# Altium schematic sheet MPU&DDR.SchDoc
size A2
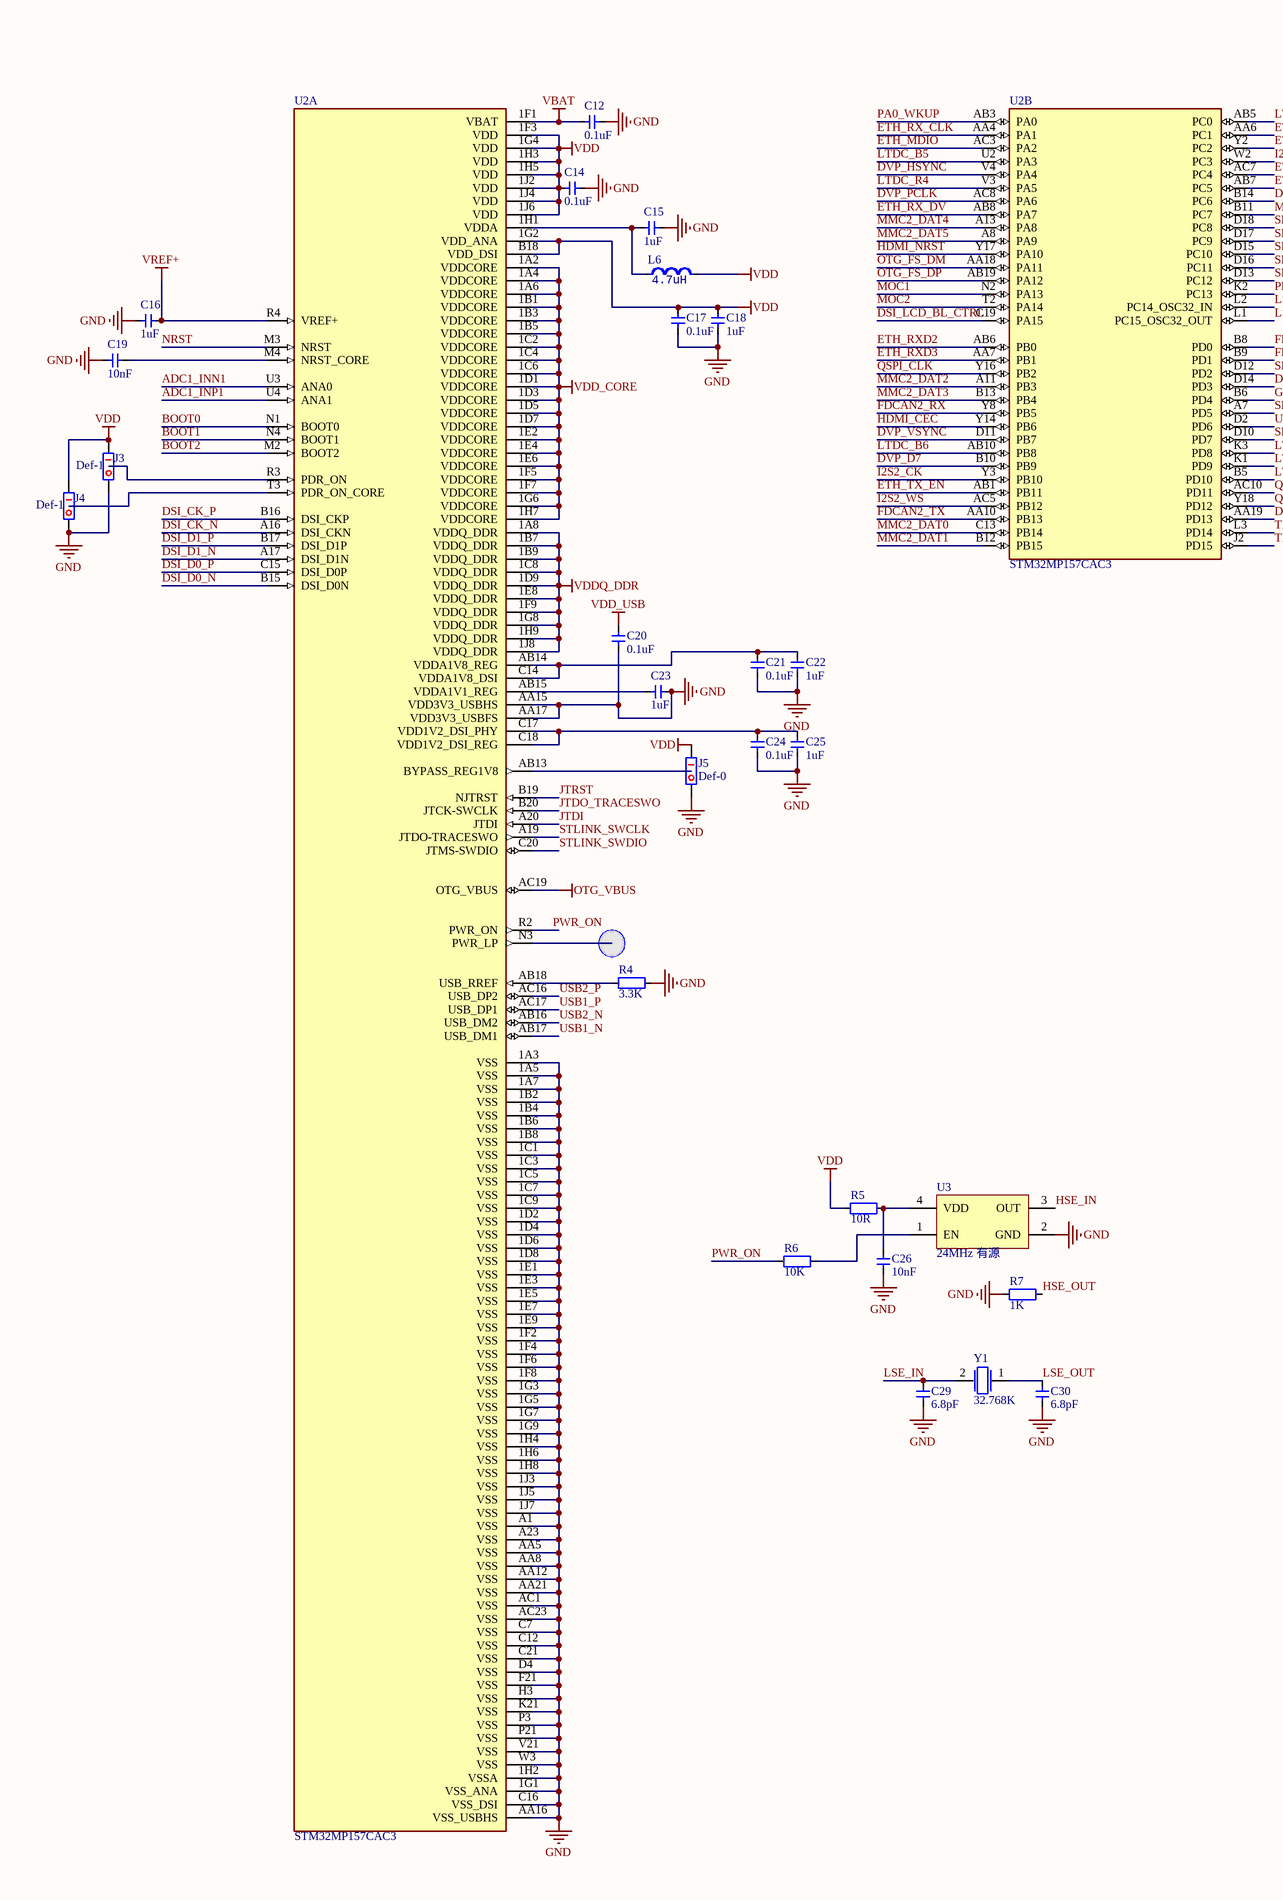
[diagram p0: MPU&DDR.SchDoc, left]
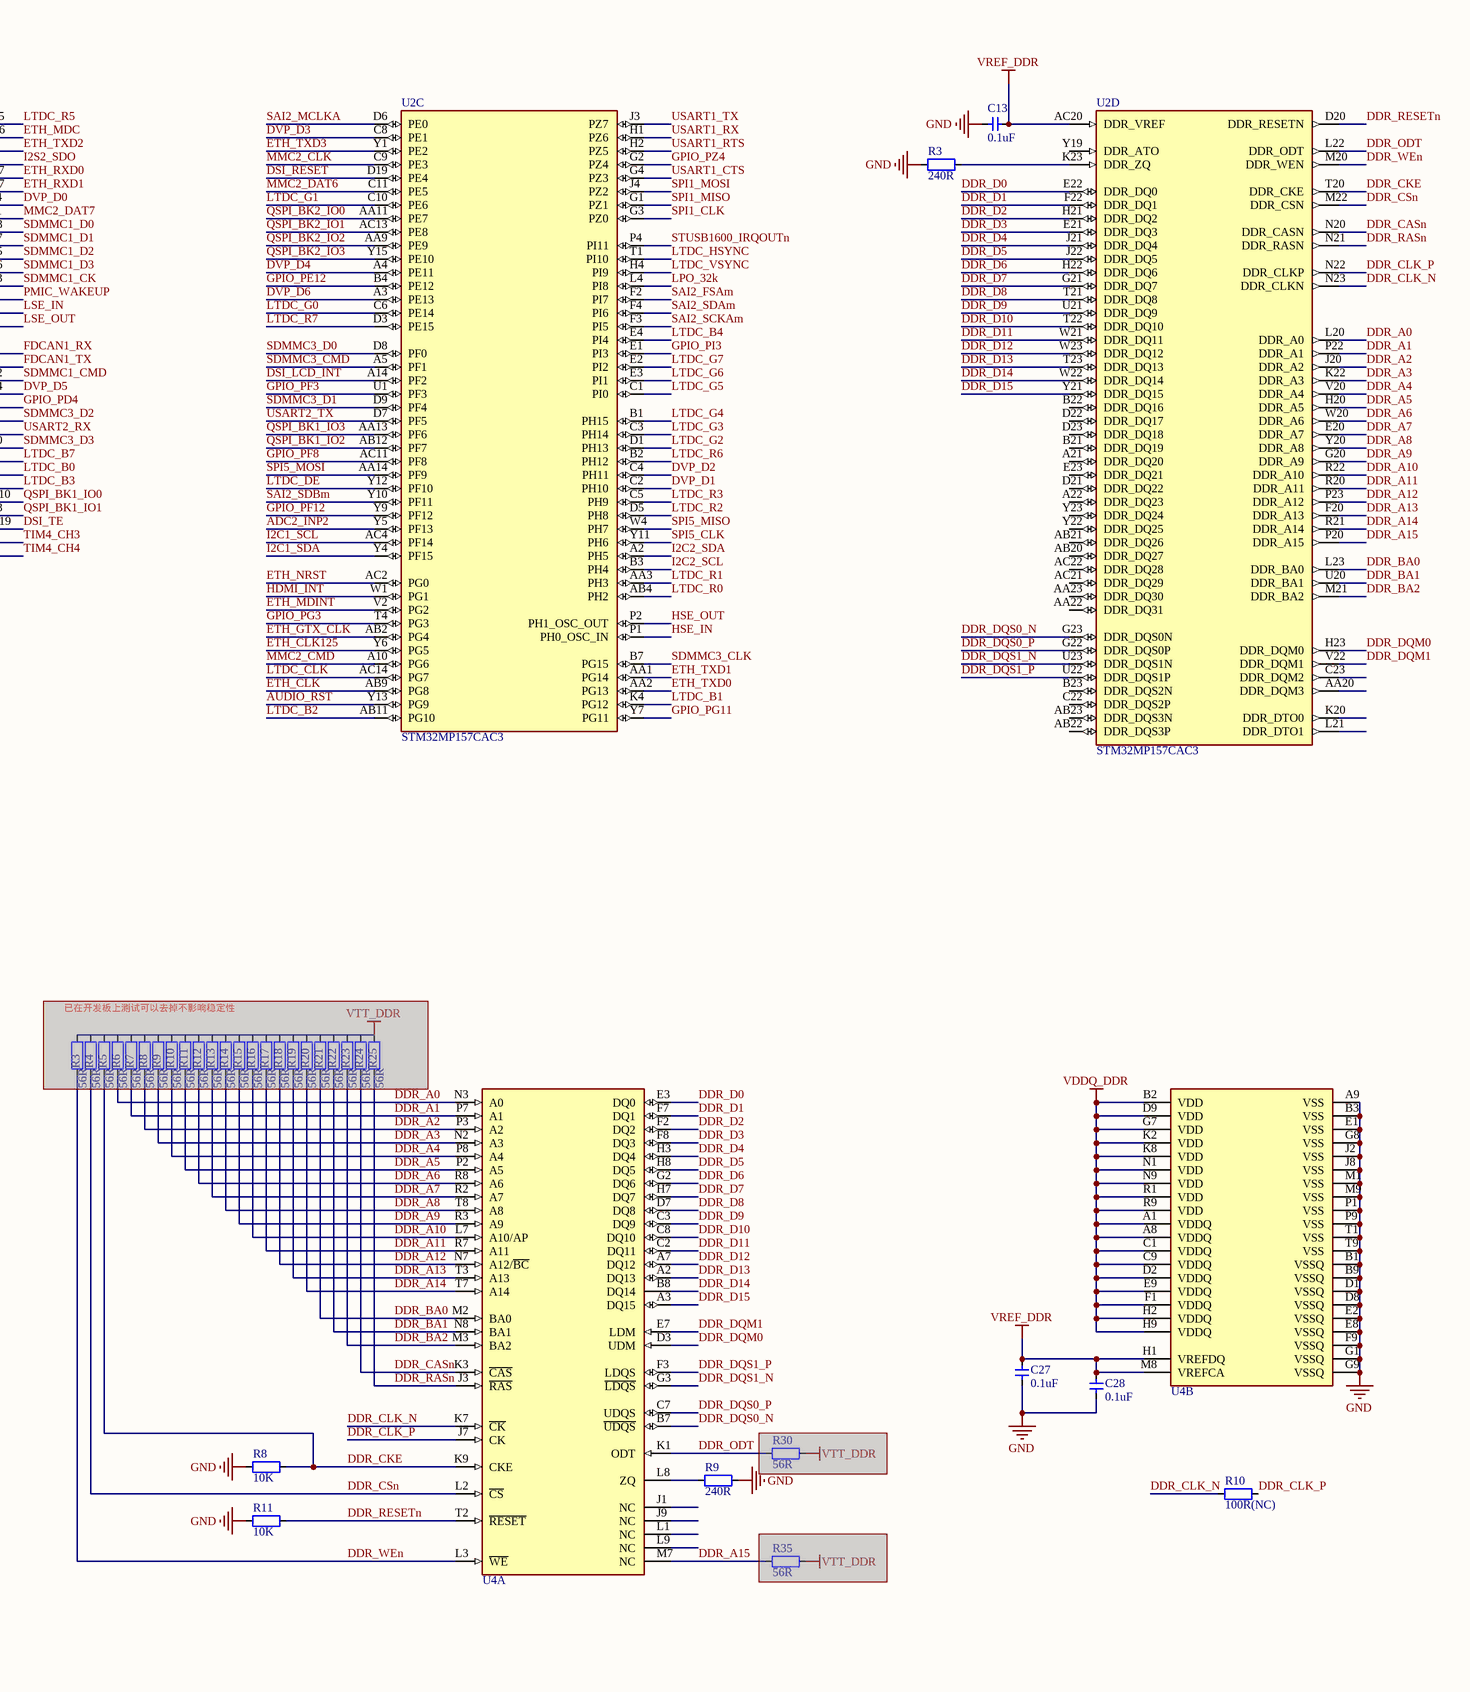
[diagram p1: MPU&DDR.SchDoc, right]

## Parts
(Parts that share a designator on the sheet are numbered #1, #2 ... from top to bottom, then left to right.)
C12  0.1uF  [CAP_0402]
C13  0.1uF  [CAP_0402]
C14  0.1uF  [CAP_0402]
C15  1uF  [CAP_0402]
C16  1uF  [CAP_0402]
C17  0.1uF  [CAP_0402]
C18  1uF  [CAP_0402]
C19  10nF  [CAP_0402]
C20  0.1uF  [CAP_0402]
C21  0.1uF  [CAP_0402]
C22  1uF  [CAP_0402]
C23  1uF  [CAP_0402]
C24  0.1uF  [CAP_0402]
C25  1uF  [CAP_0402]
C26  10nF  [CAP_0402]
C27  0.1uF  [CAP_0402]
C28  0.1uF  [CAP_0402]
C29  6.8pF  [CAP_0402]
C30  6.8pF  [CAP_0402]
J3  Def-1  [jumper-3]
J4  Def-1  [jumper-3]
J5  Def-0  [jumper-3]
L6  4.7uH  [IND_0603]
R3#1  240R  [RES_0402]
R3#2  56R  [RES_0402]  (masked out: inside a compile mask, not in the netlist)
R4#1  3.3K  [RES_0402]
R4#2  56R  [RES_0402]  (masked out: inside a compile mask, not in the netlist)
R5#1  56R  [RES_0402]  (masked out: inside a compile mask, not in the netlist)
R5#2  10R  [RES_0402]
R6#1  56R  [RES_0402]  (masked out: inside a compile mask, not in the netlist)
R6#2  10K  [RES_0402]
R7#1  56R  [RES_0402]  (masked out: inside a compile mask, not in the netlist)
R7#2  1K  [RES_0402]
R8#1  56R  [RES_0402]  (masked out: inside a compile mask, not in the netlist)
R8#2  10K  [RES_0402]
R9#1  56R  [RES_0402]  (masked out: inside a compile mask, not in the netlist)
R9#2  240R  [RES_0402]
R10#1  56R  [RES_0402]  (masked out: inside a compile mask, not in the netlist)
R10#2  100R(NC)  [RES_0402]
R11#1  56R  [RES_0402]  (masked out: inside a compile mask, not in the netlist)
R11#2  10K  [RES_0402]
R12  56R  [RES_0402]  (masked out: inside a compile mask, not in the netlist)
R13  56R  [RES_0402]  (masked out: inside a compile mask, not in the netlist)
R14  56R  [RES_0402]  (masked out: inside a compile mask, not in the netlist)
R15  56R  [RES_0402]  (masked out: inside a compile mask, not in the netlist)
R16  56R  [RES_0402]  (masked out: inside a compile mask, not in the netlist)
R17  56R  [RES_0402]  (masked out: inside a compile mask, not in the netlist)
R18  56R  [RES_0402]  (masked out: inside a compile mask, not in the netlist)
R19  56R  [RES_0402]  (masked out: inside a compile mask, not in the netlist)
R20  56R  [RES_0402]  (masked out: inside a compile mask, not in the netlist)
R21  56R  [RES_0402]  (masked out: inside a compile mask, not in the netlist)
R22  56R  [RES_0402]  (masked out: inside a compile mask, not in the netlist)
R23  56R  [RES_0402]  (masked out: inside a compile mask, not in the netlist)
R24  56R  [RES_0402]  (masked out: inside a compile mask, not in the netlist)
R25  56R  [RES_0402]  (masked out: inside a compile mask, not in the netlist)
R30  56R  [RES_0402]  (masked out: inside a compile mask, not in the netlist)
R35  56R  [RES_0402]  (masked out: inside a compile mask, not in the netlist)
T1  测试点  [TEST_PT]  (value not drawn)
U2  STM32MP157CAC3  [STM32MP157CAC3]  (parts A,B,C,D of 4)
U3  24MHz 有源  [晶振2520]
U4  MT41K256M16TW-107-P  [Micron_DDR]  (value not drawn)  (parts A,B of 2)
Y1  32.768K  [晶振-2P-2012]

## Nets
GND: C12.1 C13.2 C14.1 C15.1 C16.2 C17.2 C18.2 C19.1 C20.2 C21.2 C22.2 C23.1 C24.2 C25.2 C26.1 C27.1 C28.1 C29.1 C30.1 J3.1 J4.1 J5.1 R3#1.1 R4#1.2 R7#2.1 R8#2.2 R9#2.2 R11#2.2 U2.1A3(VSS) U2.1A5(VSS) U2.1A7(VSS) U2.1B2(VSS) U2.1B4(VSS) U2.1B6(VSS) U2.1B8(VSS) U2.1C1(VSS) U2.1C3(VSS) U2.1C5(VSS) U2.1C7(VSS) U2.1C9(VSS) U2.1D2(VSS) U2.1D4(VSS) U2.1D6(VSS) U2.1D8(VSS) U2.1E1(VSS) U2.1E3(VSS) U2.1E5(VSS) U2.1E7(VSS) U2.1E9(VSS) U2.1F2(VSS) U2.1F4(VSS) U2.1F6(VSS) U2.1F8(VSS) U2.1G1(VSS_ANA) U2.1G3(VSS) U2.1G5(VSS) U2.1G7(VSS) U2.1G9(VSS) U2.1H2(VSSA) U2.1H4(VSS) U2.1H6(VSS) U2.1H8(VSS) U2.1J3(VSS) U2.1J5(VSS) U2.1J7(VSS) U2.A1(VSS) U2.A23(VSS) U2.AA5(VSS) U2.AA8(VSS) U2.AA12(VSS) U2.AA15(VDD3V3_USBHS) U2.AA16(VSS_USBHS) U2.AA17(VDD3V3_USBFS) U2.AA21(VSS) U2.AC1(VSS) U2.AC23(VSS) U2.C7(VSS) U2.C12(VSS) U2.C16(VSS_DSI) U2.C21(VSS) U2.D4(VSS) U2.F21(VSS) U2.H3(VSS) U2.K21(VSS) U2.P3(VSS) U2.P21(VSS) U2.V21(VSS) U2.W3(VSS) U3.2(GND) U4.A9(VSS) U4.B1(VSSQ) U4.B3(VSS) U4.B9(VSSQ) U4.D1(VSSQ) U4.D8(VSSQ) U4.E1(VSS) U4.E2(VSSQ) U4.E8(VSSQ) U4.F9(VSSQ) U4.G1(VSSQ) U4.G8(VSS) U4.G9(VSSQ) U4.J2(VSS) U4.J8(VSS) U4.M1(VSS) U4.M9(VSS) U4.P1(VSS) U4.P9(VSS) U4.T1(VSS) U4.T9(VSS)
OTG_VBUS: U2.AC19(OTG_VBUS)
VBAT: C12.2 U2.1F1(VBAT)
VDD: C14.2 C17.1 C18.1 J3.3 J4.3 J5.3 L6.2 R5#2.1 U2.1F3(VDD) U2.1G2(VDD_ANA) U2.1G4(VDD) U2.1H3(VDD) U2.1H5(VDD) U2.1J2(VDD) U2.1J4(VDD) U2.1J6(VDD) U2.B18(VDD_DSI)
VDD_CORE: U2.1A2(VDDCORE) U2.1A4(VDDCORE) U2.1A6(VDDCORE) U2.1B1(VDDCORE) U2.1B3(VDDCORE) U2.1B5(VDDCORE) U2.1C2(VDDCORE) U2.1C4(VDDCORE) U2.1C6(VDDCORE) U2.1D1(VDDCORE) U2.1D3(VDDCORE) U2.1D5(VDDCORE) U2.1D7(VDDCORE) U2.1E2(VDDCORE) U2.1E4(VDDCORE) U2.1E6(VDDCORE) U2.1F5(VDDCORE) U2.1F7(VDDCORE) U2.1G6(VDDCORE) U2.1H7(VDDCORE)
VDD_USB: C20.1
VDDQ_DDR: U2.1A8(VDDQ_DDR) U2.1B7(VDDQ_DDR) U2.1B9(VDDQ_DDR) U2.1C8(VDDQ_DDR) U2.1D9(VDDQ_DDR) U2.1E8(VDDQ_DDR) U2.1F9(VDDQ_DDR) U2.1G8(VDDQ_DDR) U2.1H9(VDDQ_DDR) U2.1J8(VDDQ_DDR) U4.A1(VDDQ) U4.A8(VDDQ) U4.B2(VDD) U4.C1(VDDQ) U4.C9(VDDQ) U4.D2(VDDQ) U4.D9(VDD) U4.E9(VDDQ) U4.F1(VDDQ) U4.G7(VDD) U4.H2(VDDQ) U4.H9(VDDQ) U4.K2(VDD) U4.K8(VDD) U4.N1(VDD) U4.N9(VDD) U4.R1(VDD) U4.R9(VDD)
VREF+: C16.1 U2.R4(VREF+)
VREF_DDR: C13.1 C27.2 C28.2 U2.AC20(DDR_VREF) U4.H1(VREFDQ) U4.M8(VREFCA)
ADC1_INN1: U2.U3(ANA0)
ADC1_INP1: U2.U4(ANA1)
ADC2_INP2: U2.Y5(PF13)
AUDIO_RST: U2.Y13(PG9)
BOOT0: U2.N1(BOOT0)
BOOT1: U2.N4(BOOT1)
BOOT2: U2.M2(BOOT2)
DDR_A0: U2.L20(DDR_A0) U4.N3(A0)
DDR_A1: U2.P22(DDR_A1) U4.P7(A1)
DDR_A2: U2.J20(DDR_A2) U4.P3(A2)
DDR_A3: U2.K22(DDR_A3) U4.N2(A3)
DDR_A4: U2.V20(DDR_A4) U4.P8(A4)
DDR_A5: U2.H20(DDR_A5) U4.P2(A5)
DDR_A6: U2.W20(DDR_A6) U4.R8(A6)
DDR_A7: U2.E20(DDR_A7) U4.R2(A7)
DDR_A8: U2.Y20(DDR_A8) U4.T8(A8)
DDR_A9: U2.G20(DDR_A9) U4.R3(A9)
DDR_A10: U2.R22(DDR_A10) U4.L7(A10/AP)
DDR_A11: U2.R20(DDR_A11) U4.R7(A11)
DDR_A12: U2.P23(DDR_A12) U4.N7(A12/~{BC})
DDR_A13: U2.F20(DDR_A13) U4.T3(A13)
DDR_A14: U2.R21(DDR_A14) U4.T7(A14)
DDR_A15: U2.P20(DDR_A15) U4.M7(NC)
DDR_BA0: U2.L23(DDR_BA0) U4.M2(BA0)
DDR_BA1: U2.U20(DDR_BA1) U4.N8(BA1)
DDR_BA2: U2.M21(DDR_BA2) U4.M3(BA2)
DDR_CASn: U2.N20(DDR_CASN) U4.K3(~{CAS})
DDR_CKE: R8#2.1 U2.T20(DDR_CKE) U4.K9(CKE)
DDR_CLK_N: R10#2.1 U2.N23(DDR_CLKN) U4.K7(~{CK})
DDR_CLK_P: R10#2.2 U2.N22(DDR_CLKP) U4.J7(CK)
DDR_CSn: U2.M22(DDR_CSN) U4.L2(~{CS})
DDR_D0: U2.E22(DDR_DQ0) U4.E3(DQ0)
DDR_D1: U2.F22(DDR_DQ1) U4.F7(DQ1)
DDR_D2: U2.H21(DDR_DQ2) U4.F2(DQ2)
DDR_D3: U2.E21(DDR_DQ3) U4.F8(DQ3)
DDR_D4: U2.J21(DDR_DQ4) U4.H3(DQ4)
DDR_D5: U2.J22(DDR_DQ5) U4.H8(DQ5)
DDR_D6: U2.H22(DDR_DQ6) U4.G2(DQ6)
DDR_D7: U2.G21(DDR_DQ7) U4.H7(DQ7)
DDR_D8: U2.T21(DDR_DQ8) U4.D7(DQ8)
DDR_D9: U2.U21(DDR_DQ9) U4.C3(DQ9)
DDR_D10: U2.T22(DDR_DQ10) U4.C8(DQ10)
DDR_D11: U2.W21(DDR_DQ11) U4.C2(DQ11)
DDR_D12: U2.W23(DDR_DQ12) U4.A7(DQ12)
DDR_D13: U2.T23(DDR_DQ13) U4.A2(DQ13)
DDR_D14: U2.W22(DDR_DQ14) U4.B8(DQ14)
DDR_D15: U2.Y21(DDR_DQ15) U4.A3(DQ15)
DDR_DQM0: U2.H23(DDR_DQM0) U4.D3(UDM)
DDR_DQM1: U2.V22(DDR_DQM1) U4.E7(LDM)
DDR_DQS0_N: U2.G23(DDR_DQS0N) U4.B7(~{UDQS})
DDR_DQS0_P: U2.G22(DDR_DQS0P) U4.C7(UDQS)
DDR_DQS1_N: U2.U23(DDR_DQS1N) U4.G3(~{LDQS})
DDR_DQS1_P: U2.U22(DDR_DQS1P) U4.F3(LDQS)
DDR_ODT: U2.L22(DDR_ODT) U4.K1(ODT)
DDR_RASn: U2.N21(DDR_RASN) U4.J3(~{RAS})
DDR_RESETn: R11#2.1 U2.D20(DDR_RESETN) U4.T2(~{RESET})
DDR_WEn: U2.M20(DDR_WEN) U4.L3(~{WE})
DSI_CK_N: U2.A16(DSI_CKN)
DSI_CK_P: U2.B16(DSI_CKP)
DSI_D0_N: U2.B15(DSI_D0N)
DSI_D0_P: U2.C15(DSI_D0P)
DSI_D1_N: U2.A17(DSI_D1N)
DSI_D1_P: U2.B17(DSI_D1P)
DSI_LCD_BL_CTRL: U2.C19(PA15)
DSI_LCD_INT: U2.A14(PF2)
DSI_RESET: U2.D19(PE4)
DSI_TE: U2.AA19(PD13)
DVP_D0: U2.B14(PC6)
DVP_D1: U2.C2(PH10)
DVP_D2: U2.C4(PH11)
DVP_D3: U2.C8(PE1)
DVP_D4: U2.A4(PE11)
DVP_D5: U2.D14(PD3)
DVP_D6: U2.A3(PE13)
DVP_D7: U2.B10(PB9)
DVP_HSYNC: U2.V4(PA4)
DVP_PCLK: U2.AC8(PA6)
DVP_VSYNC: U2.D11(PB7)
ETH_CLK: U2.AB9(PG8)
ETH_CLK125: U2.Y6(PG5)
ETH_GTX_CLK: U2.AB2(PG4)
ETH_MDC: U2.AA6(PC1)
ETH_MDINT: U2.V2(PG2)
ETH_MDIO: U2.AC3(PA2)
ETH_NRST: U2.AC2(PG0)
ETH_RX_CLK: U2.AA4(PA1)
ETH_RX_DV: U2.AB8(PA7)
ETH_RXD0: U2.AC7(PC4)
ETH_RXD1: U2.AB7(PC5)
ETH_RXD2: U2.AB6(PB0)
ETH_RXD3: U2.AA7(PB1)
ETH_TX_EN: U2.AB1(PB11)
ETH_TXD0: U2.AA2(PG13)
ETH_TXD1: U2.AA1(PG14)
ETH_TXD2: U2.Y2(PC2)
ETH_TXD3: U2.Y1(PE2)
FDCAN1_RX: U2.B8(PD0)
FDCAN1_TX: U2.B9(PD1)
FDCAN2_RX: U2.Y8(PB5)
FDCAN2_TX: U2.AA10(PB13)
GPIO_PD4: U2.B6(PD4)
GPIO_PE12: U2.B4(PE12)
GPIO_PF3: U2.U1(PF3)
GPIO_PF8: U2.AC11(PF8)
GPIO_PF12: U2.Y9(PF12)
GPIO_PG3: U2.T4(PG3)
GPIO_PG11: U2.Y7(PG11)
GPIO_PI3: U2.E1(PI3)
GPIO_PZ4: U2.G2(PZ4)
HDMI_CEC: U2.Y14(PB6)
HDMI_INT: U2.W1(PG1)
HDMI_NRST: U2.Y17(PA10)
HSE_IN: U2.P1(PH0_OSC_IN) U3.3(OUT)
HSE_OUT: R7#2.2 U2.P2(PH1_OSC_OUT)
I2C1_SCL: U2.AC4(PF14)
I2C1_SDA: U2.Y4(PF15)
I2C2_SCL: U2.B3(PH4)
I2C2_SDA: U2.A2(PH5)
I2S2_CK: U2.Y3(PB10)
I2S2_SDO: U2.W2(PC3)
I2S2_WS: U2.AC5(PB12)
JTDI: U2.A20(JTDI)
JTDO_TRACESWO: U2.B20(JTCK-SWCLK)
JTRST: U2.B19(NJTRST)
LPO_32k: U2.L4(PI8)
LSE_IN: C29.2 U2.L2(PC14_OSC32_IN) Y1.2
LSE_OUT: C30.2 U2.L1(PC15_OSC32_OUT) Y1.1
LTDC_B0: U2.K1(PD9)
LTDC_B1: U2.K4(PG12)
LTDC_B2: U2.AB11(PG10)
LTDC_B3: U2.B5(PD10)
LTDC_B4: U2.E4(PI4)
LTDC_B5: U2.U2(PA3)
LTDC_B6: U2.AB10(PB8)
LTDC_B7: U2.K3(PD8)
LTDC_CLK: U2.AC14(PG7)
LTDC_DE: U2.Y12(PF10)
LTDC_G0: U2.C6(PE14)
LTDC_G1: U2.C10(PE6)
LTDC_G2: U2.D1(PH13)
LTDC_G3: U2.C3(PH14)
LTDC_G4: U2.B1(PH15)
LTDC_G5: U2.C1(PI0)
LTDC_G6: U2.E3(PI1)
LTDC_G7: U2.E2(PI2)
LTDC_HSYNC: U2.T1(PI10)
LTDC_R0: U2.AB4(PH2)
LTDC_R1: U2.AA3(PH3)
LTDC_R2: U2.D5(PH8)
LTDC_R3: U2.C5(PH9)
LTDC_R4: U2.V3(PA5)
LTDC_R5: U2.AB5(PC0)
LTDC_R6: U2.B2(PH12)
LTDC_R7: U2.D3(PE15)
LTDC_VSYNC: U2.H4(PI9)
MMC2_CLK: U2.C9(PE3)
MMC2_CMD: U2.A10(PG6)
MMC2_DAT0: U2.C13(PB14)
MMC2_DAT1: U2.B12(PB15)
MMC2_DAT2: U2.A11(PB3)
MMC2_DAT3: U2.B13(PB4)
MMC2_DAT4: U2.A13(PA8)
MMC2_DAT5: U2.A8(PA9)
MMC2_DAT6: U2.C11(PE5)
MMC2_DAT7: U2.B11(PC7)
MOC1: U2.N2(PA13)
MOC2: U2.T2(PA14)
NRST: U2.M3(NRST)
OTG_FS_DM: U2.AA18(PA11)
OTG_FS_DP: U2.AB19(PA12)
PA0_WKUP: U2.AB3(PA0)
PMIC_WAKEUP: U2.K2(PC13)
PWR_ON: R6#2.1 U2.R2(PWR_ON)
QSPI_BK1_IO0: U2.AC10(PD11)
QSPI_BK1_IO1: U2.Y18(PD12)
QSPI_BK1_IO2: U2.AB12(PF7)
QSPI_BK1_IO3: U2.AA13(PF6)
QSPI_BK2_IO0: U2.AA11(PE7)
QSPI_BK2_IO1: U2.AC13(PE8)
QSPI_BK2_IO2: U2.AA9(PE9)
QSPI_BK2_IO3: U2.Y15(PE10)
QSPI_CLK: U2.Y16(PB2)
SAI2_FSAm: U2.F2(PI7)
SAI2_MCLKA: U2.D6(PE0)
SAI2_SCKAm: U2.F3(PI5)
SAI2_SDAm: U2.F4(PI6)
SAI2_SDBm: U2.Y10(PF11)
SDMMC1_CK: U2.D13(PC12)
SDMMC1_CMD: U2.D12(PD2)
SDMMC1_D0: U2.D18(PC8)
SDMMC1_D1: U2.D17(PC9)
SDMMC1_D2: U2.D15(PC10)
SDMMC1_D3: U2.D16(PC11)
SDMMC3_CLK: U2.B7(PG15)
SDMMC3_CMD: U2.A5(PF1)
SDMMC3_D0: U2.D8(PF0)
SDMMC3_D1: U2.D9(PF4)
SDMMC3_D2: U2.A7(PD5)
SDMMC3_D3: U2.D10(PD7)
SPI1_CLK: U2.G3(PZ0)
SPI1_MISO: U2.G1(PZ1)
SPI1_MOSI: U2.J4(PZ2)
SPI5_CLK: U2.Y11(PH6)
SPI5_MISO: U2.W4(PH7)
SPI5_MOSI: U2.AA14(PF9)
STLINK_SWCLK: U2.A19(JTDO-TRACESWO)
STLINK_SWDIO: U2.C20(JTMS-SWDIO)
STUSB1600_IRQOUTn: U2.P4(PI11)
TIM4_CH3: U2.L3(PD14)
TIM4_CH4: U2.J2(PD15)
USART1_CTS: U2.G4(PZ3)
USART1_RTS: U2.H2(PZ5)
USART1_RX: U2.H1(PZ6)
USART1_TX: U2.J3(PZ7)
USART2_RX: U2.D2(PD6)
USART2_TX: U2.D7(PF5)
USB1_N: U2.AB17(USB_DM1)
USB1_P: U2.AC17(USB_DP1)
USB2_N: U2.AB16(USB_DM2)
USB2_P: U2.AC16(USB_DP2)
NetC15_2: C15.2 L6.1 U2.1H1(VDDA)
NetC19_2: C19.2 U2.M4(NRST_CORE)
NetC21_1: C21.1 C22.1 U2.AB14(VDDA1V8_REG) U2.C14(VDDA1V8_DSI)
NetC23_2: C23.2 U2.AB15(VDDA1V1_REG)
NetC24_1: C24.1 C25.1 U2.C17(VDD1V2_DSI_PHY) U2.C18(VDD1V2_DSI_REG)
NetC26_2: C26.2 R5#2.2 U3.4(VDD)
NetJ3_2: J3.2 U2.R3(PDR_ON)
NetJ4_2: J4.2 U2.T3(PDR_ON_CORE)
NetJ5_2: J5.2 U2.AB13(BYPASS_REG1V8)
NetR3#1_2: R3#1.2 U2.K23(DDR_ZQ)
NetR4#1_1: R4#1.1 U2.AB18(USB_RREF)
NetR6#2_2: R6#2.2 U3.1(EN)
NetR9#2_1: R9#2.1 U4.L8(ZQ)
NetT1_0: T1.0 U2.N3(PWR_LP)

Not connected (* = marked no-connect by the designer): U2 A21(DDR_DQ20) A22(DDR_DQ23) AA20(DDR_DQM3) AA22(DDR_DQ31) AA23(DDR_DQ30) AB20(DDR_DQ27) AB21(DDR_DQ26) AB22(DDR_DQS3P) AB23(DDR_DQS3N) AC21(DDR_DQ29) AC22(DDR_DQ28) B21(DDR_DQ19) B22(DDR_DQ16) B23(DDR_DQS2N) C22(DDR_DQS2P) C23(DDR_DQM2) D21(DDR_DQ22) D22(DDR_DQ17) D23(DDR_DQ18) E23(DDR_DQ21) K20(DDR_DTO0) L21(DDR_DTO1) Y19(DDR_ATO) Y22(DDR_DQ25) Y23(DDR_DQ24); U4 J1(NC) J9(NC) L1(NC) L9(NC)

## Notes on the sheet
- 已在开发板上测试可以去掉不影响稳定性

## Library data of the parts
C12-C30 = 电容-0402: Capacitor; Value: 0.1u
J3-J5 = 选择跳线: Resistor; Published: 8-Jun-2000; LatestRevisionDate: 17-Jul-2002; LatestRevisionNote: Re-released for DXP Platform.; PackageReference: AXIAL-0.4; Publisher: Altium Limited; PackageDescription: Axial Device, Thru-Hole; 2 Leads; 0.4 in Pin Spacing
L6 = Ind_0603: Inductor; Specification: ±5% 100mA; Type: 0603; Manufacturer: *; Value: 4.7uH
R3#1 R3#2 R4#1 R4#2 R5#1 R5#2 R6#1 R6#2 R7#1 R7#2 R8#1 R8#2 R9#1 R9#2 R10#1 R10#2 R11#1 R11#2 R12-R25 R30 R35 = 电阻-0402: Resistor; Value: 22R
U2 = STM32MP157CAC3: ARM® Cortex®-A7 Microprocessor IC STM32MP1 2 Core, 32-Bit 209MHz, 650MHz 361-TFBGA (12x12); MP: STM32MP157AAC3; MF: STMicroelectronics; Value: *; SnapEDA_Link: https://www.snapeda.com/parts/STM32MP157AAC3/STMicroelectronics/view-part/3660522/?ref=snap; Price: None; Mouser-Purchase-URL: https://snapeda.com/shop?store=Mouser&id=3660522; Package: TFBGA-361 STMicroelectronics; DigiKey-Purchase-URL: https://snapeda.com/shop?store=DigiKey&id=3660522; Availability: Bad
U3 = 晶振-4Pin-有源: 2520
Y1 = 晶振-32k-2012: 村田贴片